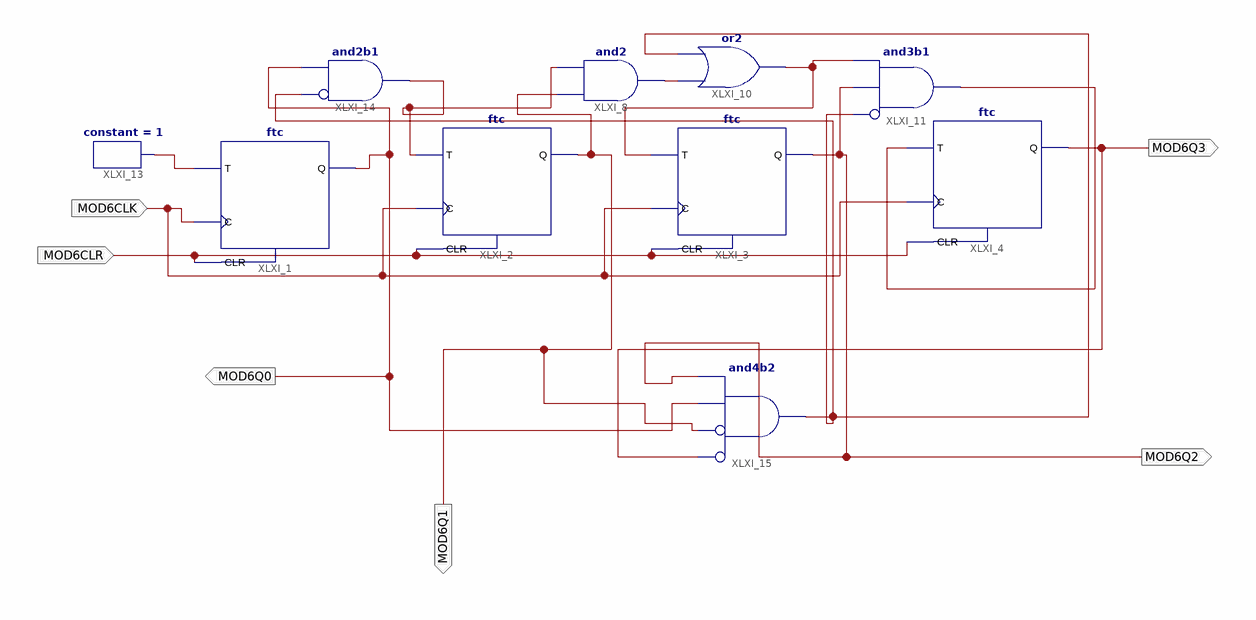
[diagram p0: schematic sheet 1]
// Xilinx ISE schematic MOD6COUNTER.sch (spartan6) as structural Verilog: 10 symbols, 6 ports
module MOD6COUNTER (
  input  MOD6CLK,
  input  MOD6CLR,
  output MOD6Q3,
  output MOD6Q0,
  output MOD6Q1,
  output MOD6Q2
);

  wire XLXN_10, XLXN_19, XLXN_23, XLXN_27, XLXN_32, XLXN_33;

  ftc XLXI_1 (.C(MOD6CLK), .CLR(MOD6CLR), .T(XLXN_27), .Q(MOD6Q0));
  ftc XLXI_2 (.C(MOD6CLK), .CLR(MOD6CLR), .T(XLXN_33), .Q(MOD6Q1));
  ftc XLXI_3 (.C(MOD6CLK), .CLR(MOD6CLR), .T(XLXN_19), .Q(MOD6Q2));
  ftc XLXI_4 (.C(MOD6CLK), .CLR(MOD6CLR), .T(XLXN_23), .Q(MOD6Q3));
  and XLXI_8 (XLXN_10, MOD6Q1, XLXN_33);
  or XLXI_10 (XLXN_19, XLXN_10, XLXN_32);
  and XLXI_11 (XLXN_23, ~XLXN_32, MOD6Q2, XLXN_19);  // and3b1
  constant #(.CValue("1")) XLXI_13 (.O(XLXN_27));
  and XLXI_14 (XLXN_33, ~XLXN_32, MOD6Q0);  // and2b1
  and XLXI_15 (XLXN_32, ~MOD6Q3, ~MOD6Q1, MOD6Q0, MOD6Q2);  // and4b2
endmodule
